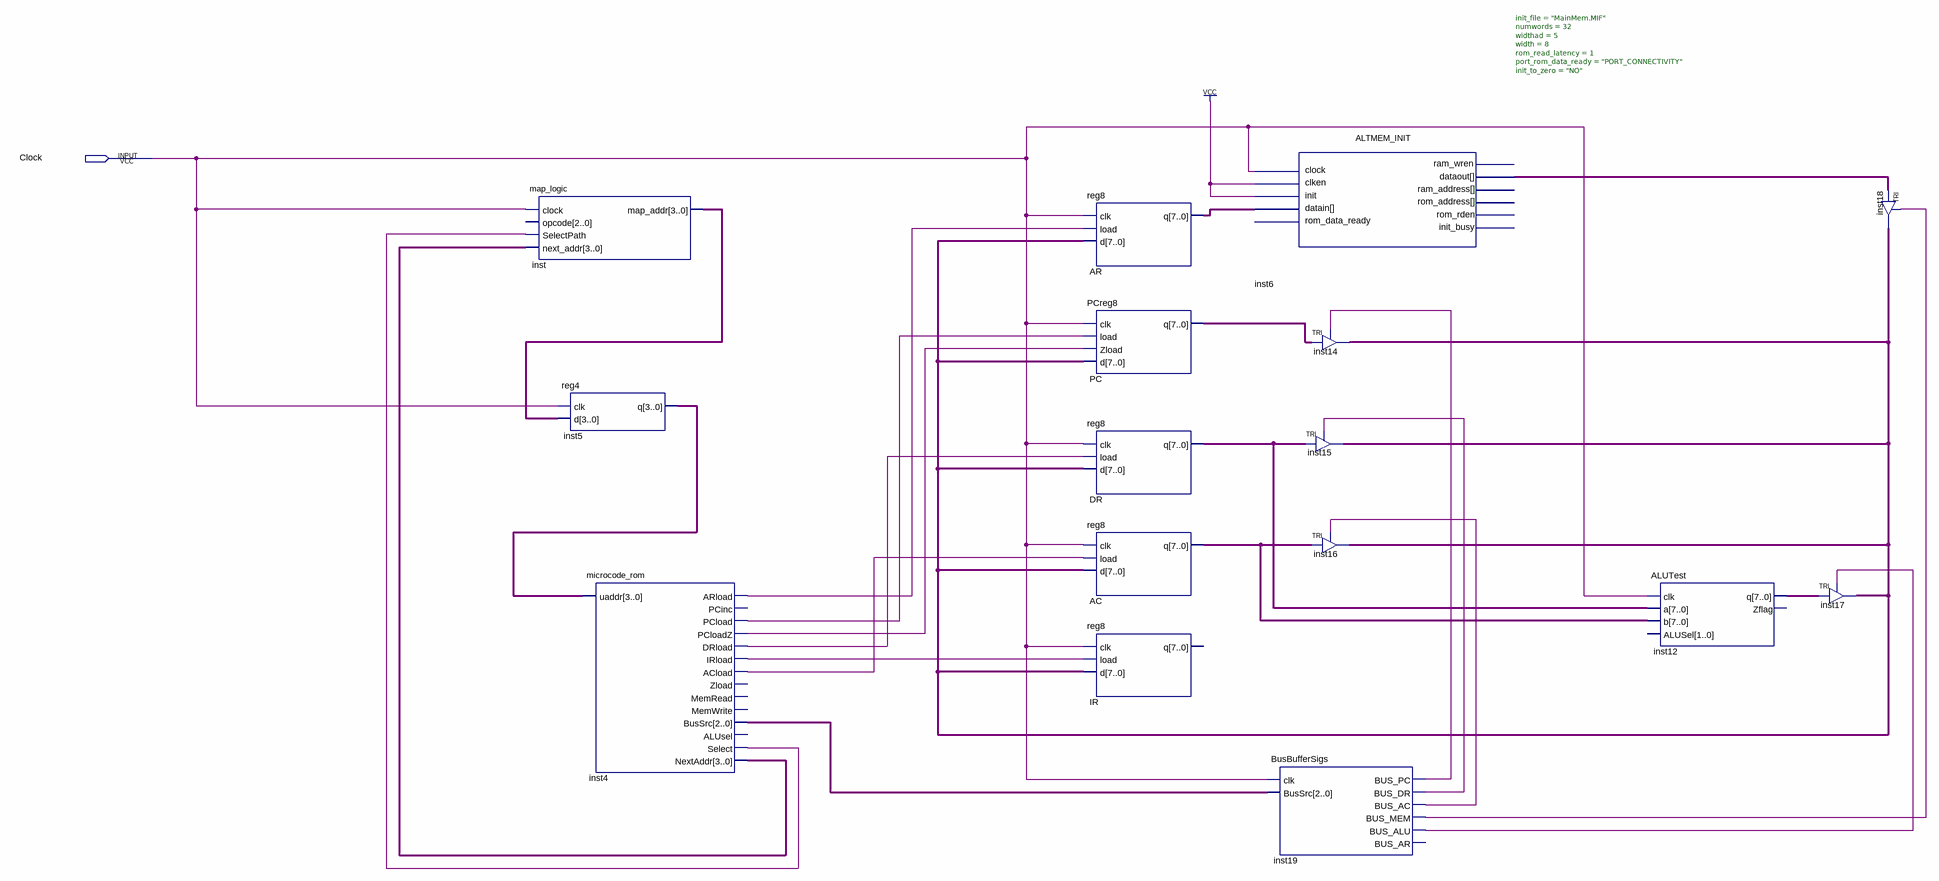
[diagram p0: schematic sheet]
// Quartus schematic CE4720_SimpleCPU.bdf as structural Verilog: 16 symbols, 1 pins
module CE4720_SimpleCPU (
  input  Clock
);

  wire inst4_acload, inst4_arload, inst4_drload, inst4_irload, inst4_pcload, inst4_pcloadz, inst4_select,
       inst19_bus_ac, inst19_bus_alu, inst19_bus_dr, inst19_bus_mem, inst19_bus_pc;
  wire [2:0] inst4_bussrc;
  wire [3:0] inst4_nextaddr, inst5_q, inst_map_addr;
  wire [7:0] AC_q, AR_q, DR_q, inst6_dataout, inst12_q, inst14_out, PC_q;

  map_logic inst (
    .clock(Clock), .SelectPath(inst4_select), .next_addr(inst4_nextaddr), .map_addr(inst_map_addr));  // open: opcode
  reg4 inst5 (.clk(Clock), .d(inst_map_addr), .q(inst5_q));
  microcode_rom inst4 (
    .uaddr(inst5_q), .ARload(inst4_arload), .PCload(inst4_pcload), .PCloadZ(inst4_pcloadz),
    .DRload(inst4_drload), .IRload(inst4_irload), .ACload(inst4_acload), .BusSrc(inst4_bussrc),
    .Select(inst4_select), .NextAddr(inst4_nextaddr));  // open: PCinc, Zload, MemRead, MemWrite, ALUsel
  reg8 AR (.clk(Clock), .load(inst4_arload), .d(inst14_out), .q(AR_q));
  PCreg8 PC (.clk(Clock), .load(inst4_pcload), .Zload(inst4_pcloadz), .d(inst14_out), .q(PC_q));
  reg8 DR (.clk(Clock), .load(inst4_drload), .d(inst14_out), .q(DR_q));
  reg8 AC (.clk(Clock), .load(inst4_acload), .d(inst14_out), .q(AC_q));
  reg8 IR (.clk(Clock), .load(inst4_irload), .d(inst14_out));  // open: q
  ALTMEM_INIT #(.init_file("MainMem.MIF"), .numwords(32), .widthad(5), .width(8), .rom_read_latency(1), .port_rom_data_ready("PORT_CONNECTIVITY"), .init_to_zero("NO")) inst6 (
    .clock(Clock), .clken(1'b1), .init(1'b1), .datain(AR_q), .dataout(inst6_dataout));  // open: rom_data_ready, ram_wren, rom_rden, ram_address, rom_address, init_busy
  BusBufferSigs inst19 (
    .clk(Clock), .BusSrc(inst4_bussrc), .BUS_PC(inst19_bus_pc), .BUS_DR(inst19_bus_dr),
    .BUS_AC(inst19_bus_ac), .BUS_MEM(inst19_bus_mem), .BUS_ALU(inst19_bus_alu));  // open: BUS_AR
  TRI inst14[7:0] (.IN(PC_q), .OE(inst19_bus_pc), .OUT(inst14_out));
  TRI inst15[7:0] (.IN(DR_q), .OE(inst19_bus_dr), .OUT(inst14_out));
  TRI inst16[7:0] (.IN(AC_q), .OE(inst19_bus_ac), .OUT(inst14_out));
  ALUTest inst12 (.clk(Clock), .a(DR_q), .b(AC_q), .q(inst12_q));  // open: ALUSel, Zflag
  TRI inst17[7:0] (.IN(inst12_q), .OE(inst19_bus_alu), .OUT(inst14_out));
  TRI inst18[7:0] (.IN(inst6_dataout), .OE(inst19_bus_mem), .OUT(inst14_out));
endmodule
